# EAGLE schematic 5Wled-driver_001 (EAGLE 6.2)
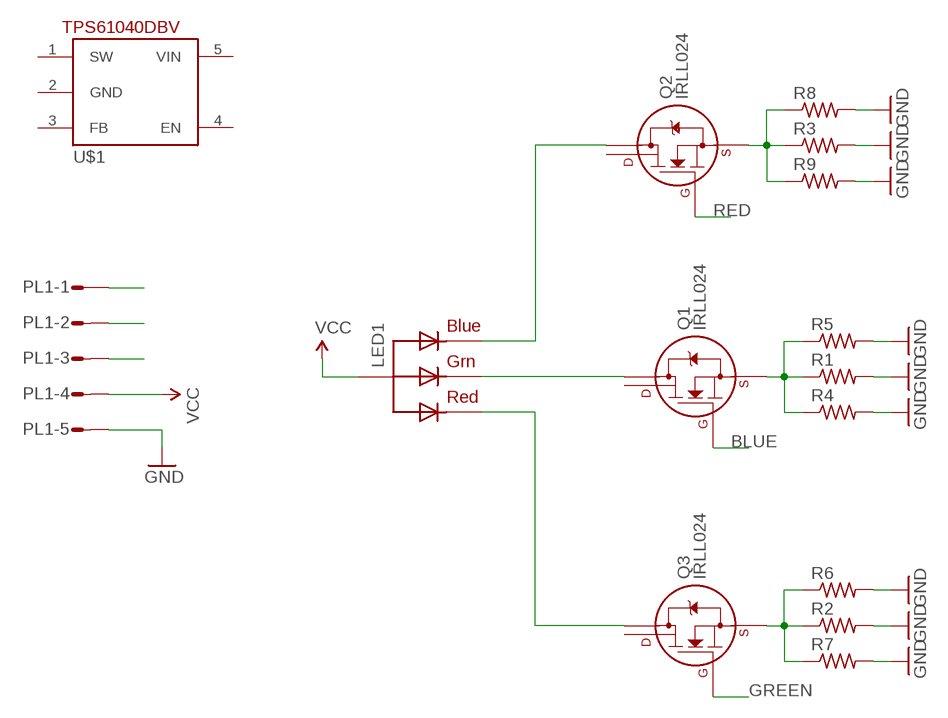
[diagram p0: schematic, sheet 1]

## Parts
LED1  RGBLED_CA4.5MM  [5WRGBLED]
PL1  DF3-05R  [DF3R-05]
Q1  IRLL024  [SOT-223]
Q2  IRLL024  [SOT-223]
Q3  IRLL024  [SOT-223]
R1  R-US_R2012  [R2012]
R2  R-US_R2012  [R2012]
R3  R-US_R2012  [R2012]
R4  R-US_R2012  [R2012]
R5  R-US_R2012  [R2012]
R6  R-US_R2012  [R2012]
R7  R-US_R2012  [R2012]
R8  R-US_R2012  [R2012]
R9  R-US_R2012  [R2012]
U$1  TPS61040DBV  [SOT23-5L]

## Nets
BLUE: PL1.1 Q1.1(G)
GND: PL1.5 R1.2 R2.2 R3.2 R4.2 R5.2 R6.2 R7.2 R8.2 R9.2
GREEN: PL1.2 Q3.1(G)
N$1: LED1.3(GREEN) Q1.2(D1)
N$2: LED1.1(BLUE) Q2.2(D1)
N$3: LED1.2(RED) Q3.2(D1)
N$4: Q1.3(S) R1.1 R4.1 R5.1
N$5: Q3.3(S) R2.1 R6.1 R7.1
N$6: Q2.3(S) R3.1 R8.1 R9.1
RED: PL1.3 Q2.1(G)
VCC: LED1.4(VCC) PL1.4
Unconnected: Q1.4(D2) Q2.4(D2) Q3.4(D2) U$1.1(SW) U$1.3(FB) U$1.4(EN)

## Power pins joined to a net without a drawn wire
GND: U$1.2(GND)
VIN: U$1.5(VIN)

## Library data of the parts
LED1 = adafruit:RGBLED_CA: RGB LED, common-anode 5MM Staggered pins 5mm Piranha package http://www.ladyada.net/library/pcb/eaglelibrary.html
PL1 = con-hirose-df3:DF3-05: Single row connector 2mm 5 way
Q1-Q3 = transistors:IRLL*: International Rectifier IRLL series N-channel enhancement mode MOSFET HEXFET Power MOSFET SOT-223 Includes body diode
R1-R9 = adafruit:R-US_: RESISTOR, American symbol
U$1 = adafruit:TPS61040DBV: TPS61040 LED Driver http://www.mouser.com/ds/2/405/slvs413f-120701.pdf